# EAGLE design IntegratedSensor (EAGLE 6.3)
Menlo Park Innovation LLC Sensor Front End Electronics
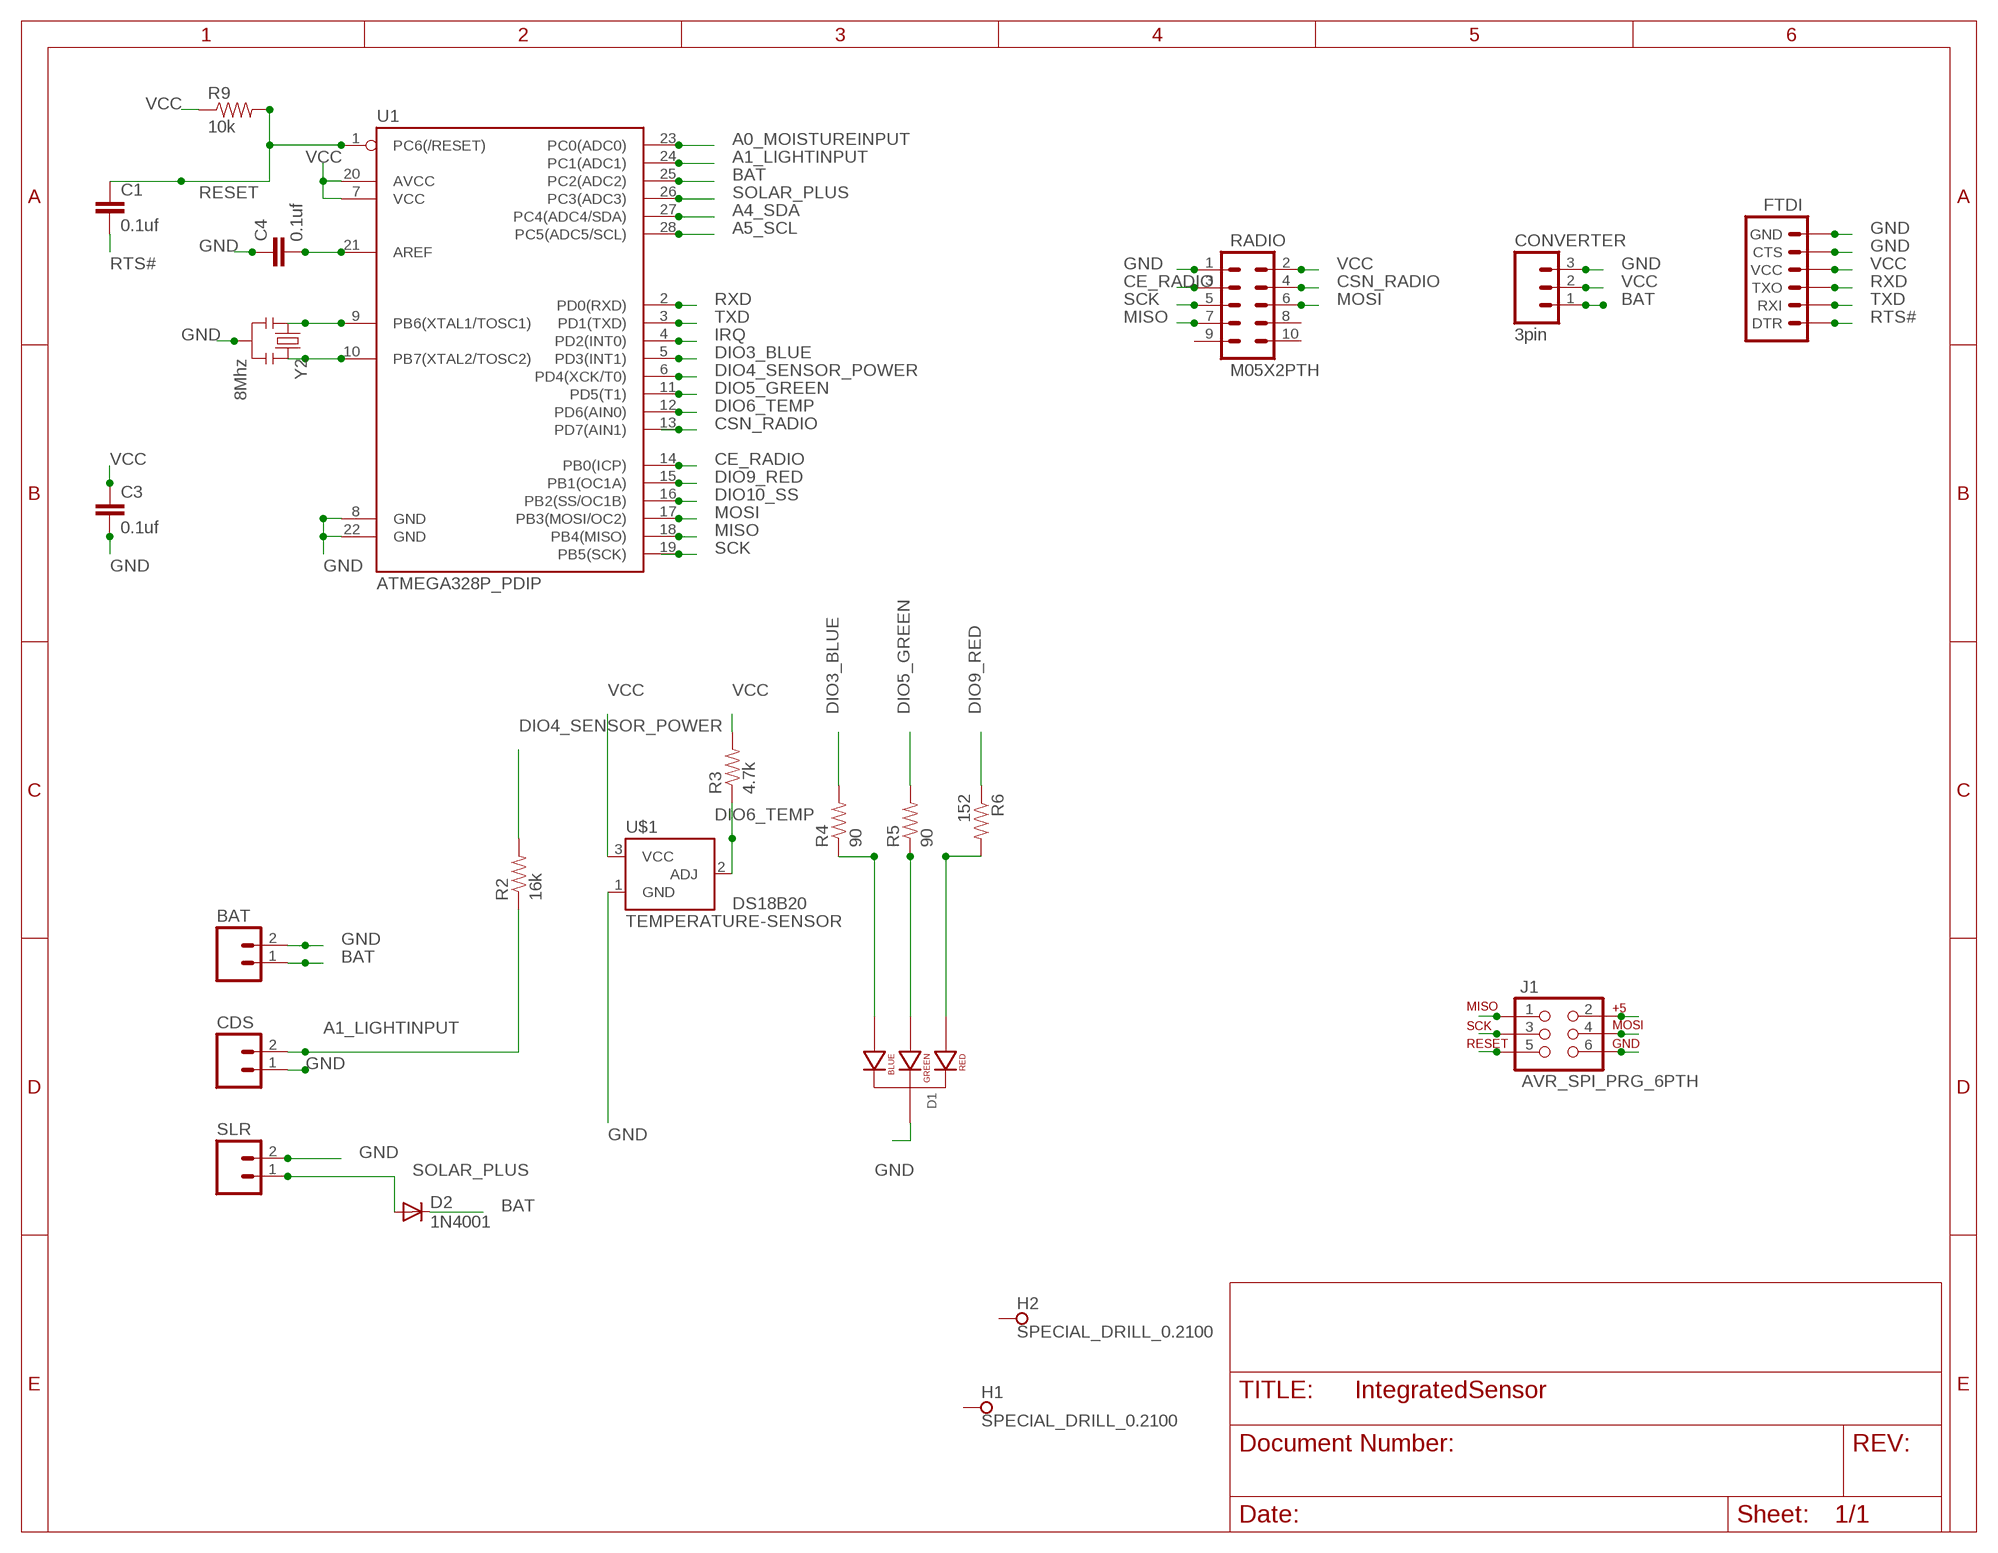
[diagram p0: schematic, sheet 1]

## Parts
BAT  M02PTH  [1X02]
C1  0.1uf  CAPPTH  [CAP-PTH-SMALL]
C3  0.1uf  CAPPTH  [CAP-PTH-SMALL]
C4  0.1uf  CAPPTH  [CAP-PTH-SMALL]
CDS  M02PTH  [1X02]
CONVERTER  3pin  M03PTH  [1X03]
D1  LED-RGB-CC-THRUCLEAR  [LED-RGB-THRU]
D2  1N4001  DIODEPTH  [DIODE-1N4001]
FTDI  ARDUINO_SERIAL_PROGRAMPTH  [1X06]
H1  SPECIAL_DRILL_0.2100  [PAD_0.2100]
H2  SPECIAL_DRILL_0.2100  [PAD_0.2100]
J1  AVR_SPI_PRG_6PTH  [2X3]
R2  16k  RESISTORPTH-1/6W  [1/6W-RES]
R3  4.7k  RESISTORPTH-1/6W  [1/6W-RES]
R4  90  RESISTORPTH-1/6W  [1/6W-RES]
R5  90  RESISTORPTH-1/6W  [1/6W-RES]
R6  152  RESISTORPTH-1/6W  [1/6W-RES]
R9  10k  RESISTORPTH-1/6W  [1/6W-RES]
RADIO  M05X2PTH  [AVR_ICSP]
SLR  M02PTH  [1X02]
U1  ATMEGA328P_PDIP  [DIL28-3]
U$1  TEMPERATURE-SENSOR  [TO-92]
Y2  8Mhz  RESONATORPTH  [RESONATOR-PTH]

## Nets
A0_MOISTUREINPUT: U1.23(PC0(ADC0))
A1_LIGHTINPUT: CDS.2 R2.1 U1.24(PC1(ADC1))
A4_SDA: U1.27(PC4(ADC4/SDA))
A5_SCL: U1.28(PC5(ADC5/SCL))
BAT: BAT.1 CONVERTER.1 D2.C U1.25(PC2(ADC2))
CE_RADIO: RADIO.3 U1.14(PB0(ICP))
CSN_RADIO: RADIO.4 U1.13(PD7(AIN1))
DIO3_BLUE: R4.2 U1.5(PD3(INT1))
DIO4_SENSOR_POWER: R2.2 U1.6(PD4(XCK/T0))
DIO5_GREEN: R5.2 U1.11(PD5(T1))
DIO6_TEMP: R3.1 U1.12(PD6(AIN0)) U$1.2(ADJ)
DIO9_RED: R6.1 U1.15(PB1(OC1A))
DIO10_SS: U1.16(PB2(SS/OC1B))
GND: BAT.2 C3.2 C4.1 CDS.1 CONVERTER.3 D1.2(CATHODE) FTDI.5(CTS) FTDI.6(GND) J1.6 RADIO.1 SLR.2 U1.8(GND) U1.22(GND) U$1.1(GND) Y2.2
IRQ: U1.4(PD2(INT0))
MISO: J1.1 RADIO.7 U1.18(PB4(MISO))
MOSI: J1.4 RADIO.6 U1.17(PB3(MOSI/OC2))
N$1: D1.4(BLUE_CATHODE) R4.1
N$2: D1.3(GREEN_CATHODE) R5.1
N$3: D1.1(RED_CATHODE) R6.2
N$5: U1.9(PB6(XTAL1/TOSC1)) Y2.1
N$6: U1.10(PB7(XTAL2/TOSC2)) Y2.3
N$8: C4.2 U1.21(AREF)
RESET: C1.1 J1.5 R9.2 U1.1(PC6(/RESET))
RTS#: C1.2 FTDI.1(DTR)
RXD: FTDI.3(TXO) U1.2(PD0(RXD))
SCK: J1.3 RADIO.5 U1.19(PB5(SCK))
SOLAR_PLUS: D2.A SLR.1 U1.26(PC3(ADC3))
TXD: FTDI.2(RXI) U1.3(PD1(TXD))
VCC: C3.1 CONVERTER.2 FTDI.4(VCC) J1.2 R3.2 R9.1 RADIO.2 U1.7(VCC) U1.20(AVCC) U$1.3(VCC)
Unconnected: H1.1 H2.1 RADIO.8 RADIO.9 RADIO.10

## Library data of the parts
BAT CDS SLR = SparkFun-Connectors:M02: Header 2 Standard 2-pin 0.1" header. Use with straight break away headers (SKU : PRT-00116), right angle break away headers (PRT-00553), swiss pins (PRT-00743), machine pins (PRT-00117), and female headers (PRT-00115). Molex polarized connector foot print use with SKU : PRT-08233 with associated crimp pins and housings.
C1 C3 C4 = SparkFun-Capacitors:CAP: Capacitor Standard 0603 ceramic capacitor, and 0.1" leaded capacitor.
CONVERTER = SparkFun-Connectors:M03: Header 3 Standard 3-pin 0.1" header. Use with straight break away headers (SKU : PRT-00116), right angle break away headers (PRT-00553), swiss pins (PRT-00743), machine pins (PRT-00117), and female headers (PRT-00115). Molex polarized connector foot print use with SKU : PRT-08232 with associated crimp pins and housings.
D1 = SparkFun-LED-MenloFix:LED-RGB-CC-THRU: RGB Through-hole common cathode LED SparkFun Storefront: COM-00105 (Clear) COM-09264 (Diffuse); PROD_ID: DIO-08418
D2 = SparkFun-DiscreteSemi:DIODE: Diode These are standard reverse protection diodes and small signal diodes. SMA package can handle up to about 1A. SOD-323 can handle about 200mA. What the SOD-323 package when ordering, there are some mfgs out there that are 5-pin packages.
FTDI = SparkFun-Connectors:ARDUINO_SERIAL_PROGRAM: FTDI connector footprints
H1 H2 = special-drill:SPECIAL_DRILL_: Special drills
J1 = SparkFun-Connectors:AVR_SPI_PRG_6: AVR ISP 6 Pin This is the reduced ISP connector for AVR programming. Common on Arduino. This footprint will take up less PCB space and can be used with a 10-pin to 6-pin adapter such as SKU: BOB-08508
R2-R6 R9 = SparkFun-Resistors:RESISTOR: Resistor Basic schematic elements and footprints for 0603, 1206, and PTH resistors.
RADIO = SparkFun-Connectors:M05X2: Header 5x2 Standard 10-pin dual row 0.1" header. Commonly used with AVR-ISP. Use with Spark Fun Electronics SKU: PRT-00778
U1 = SparkFun-DigitalIC:ATMEGA328P_PDIP: uC used in the Arduino 32kb flash, 1k EEPROM, 2k SRAM This is the through-hole version of this chip.
U$1 = SparkFun-Sensors:TEMPERATURE-SENSOR: TO-92 temp sensor; PARTNAME: DS18B20
Y2 = SparkFun-FreqCtrl:RESONATOR: Resonator Small SMD resonator. Used, eg, on the Arduino Pro/ Pro Mini boards. 8MHz- XTAL-08895 16MHz- XTAL-08900

## Board
MenloSensor1
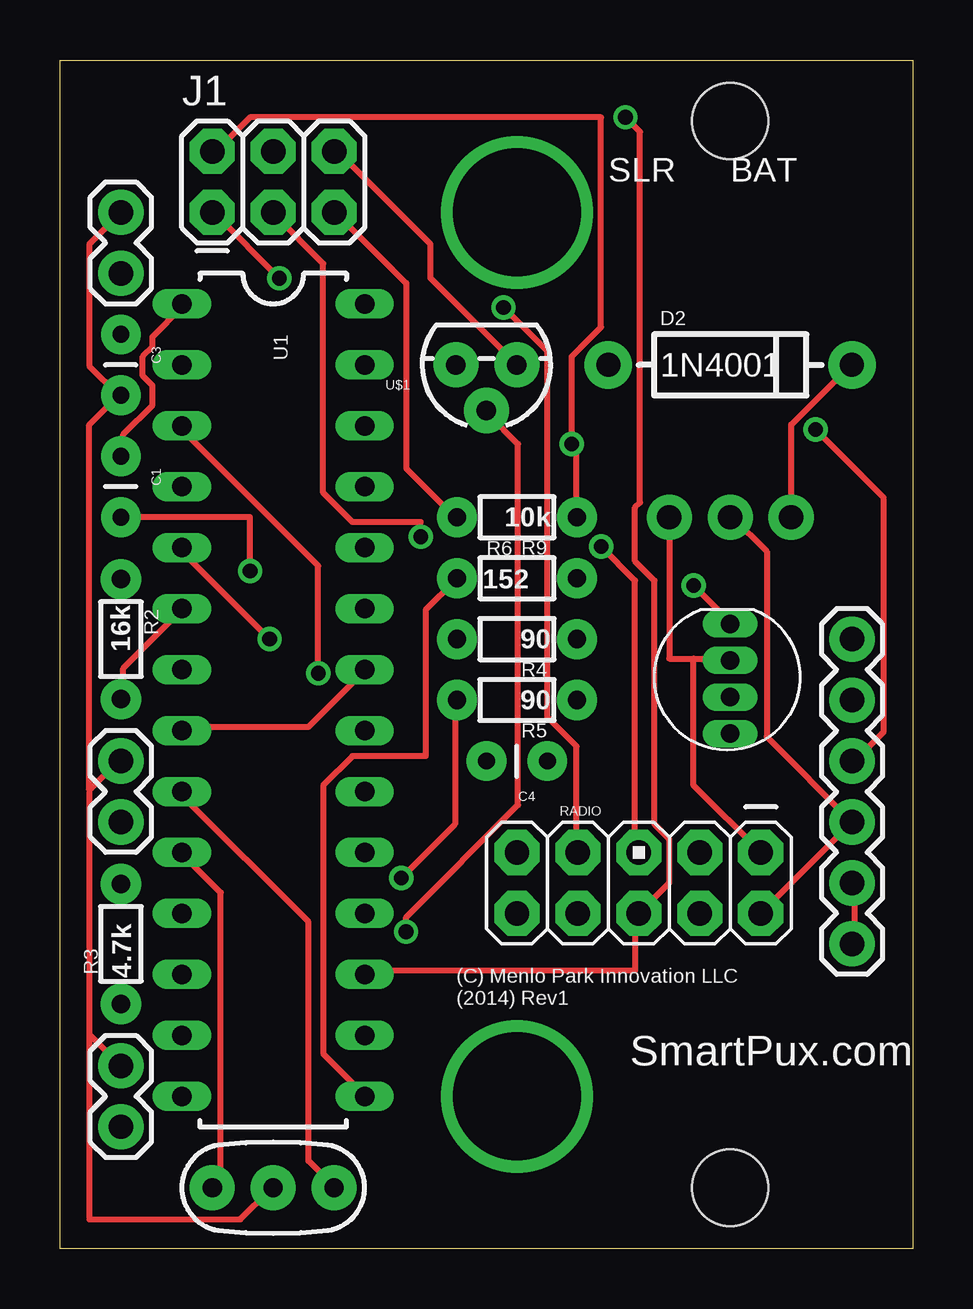
[diagram p1: board, top side]
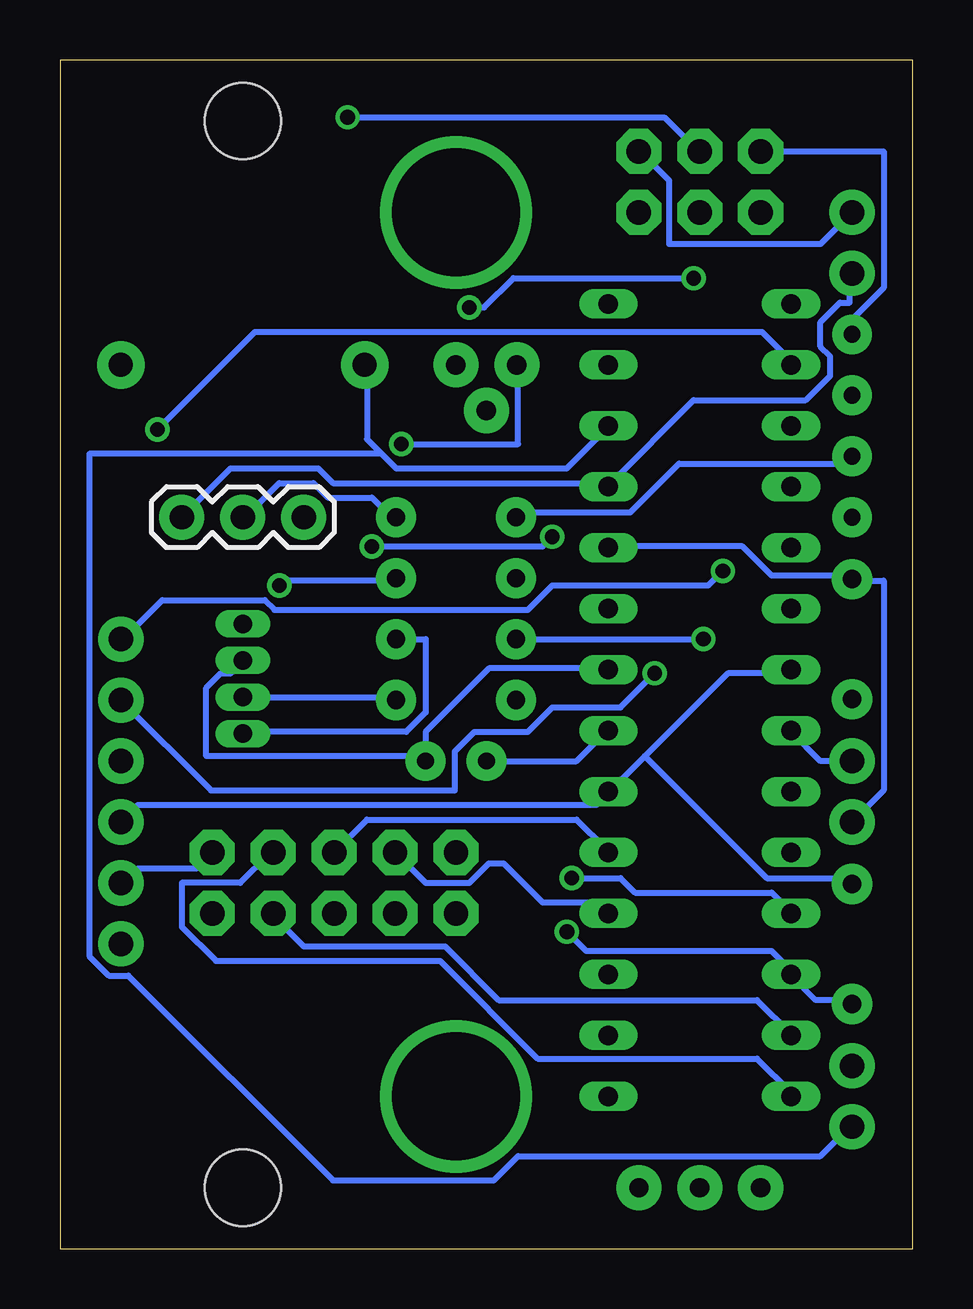
[diagram p2: board, bottom side, seen from below]

Size 35.56 x 49.53 mm. Coordinates in mm from the lower left corner, seen from the top.
Outline: 0,0 0,49.53 35.56,49.53 35.56,0 0,0
Copper layers (1*16): Top 0.035mm / dielectric 1.5mm / Bottom 0.035mm
Design rules "default *": minimum track width 10mil, minimum drill 24mil, track to track 8mil, track to pad 8mil, pad to pad 8mil, via to via 8mil, smd to smd 8mil, copper to edge 40mil, drill to drill 8mil, minimum pad ring 0mil, minimum via ring 8mil, stop-mask expansion 4mil, vias tented up to drill 0mil, thermal gap 10mil

### Footprints (pad centres in the part's own frame; a part is rotated, then mirrored left to right if it is on the bottom)
1X02 = drill 1.016 pad 1.88: 1 0,0; 2 2.54,0
CAP-PTH-SMALL = drill 0.7 pad 1.651: 1 0,0; 2 2.54,0
1X03 = drill 1.016 pad 1.88: 1 0,0; 2 2.54,0; 3 5.08,0
LED-RGB-THRU = drill 0.762 pad 0.889 long: 1 1.905,0; 2 0.381,0; 3 -1.143,0; 4 -2.667,0
DIODE-1N4001 = drill 1 pad 1.981: A -5.08,0; C 5.08,0
1X06 = drill 1.016 pad 1.88: 1 0,0; 2 2.54,0; 3 5.08,0; 4 7.62,0; 5 10.16,0; 6 12.7,0
PAD_0.2100 = drill 5.334 pad 5.334: 1 0,0
2X3 = drill 1.016 pad 1.88 octagon: 1 0,0; 2 0,2.54; 3 2.54,0; 4 2.54,2.54; 5 5.08,0; 6 5.08,2.54
1/6W-RES = drill 0.762 pad 1.676: 1 -2.5,0; 2 2.5,0
AVR_ICSP = drill 1.016 pad 1.88 octagon: 1 -1.27,5.08; 2 1.27,5.08; 3 -1.27,2.54; 4 1.27,2.54; 5 -1.27,0; 6 1.27,0; 7 -1.27,-2.54; 8 1.27,-2.54; 9 -1.27,-5.08; 10 1.27,-5.08
DIL28-3 = drill 0.813 long: 1 -16.51,-3.81; 2 -13.97,-3.81; 3 -11.43,-3.81; 4 -8.89,-3.81; 5 -6.35,-3.81; 6 -3.81,-3.81; 7 -1.27,-3.81; 8 1.27,-3.81; 9 3.81,-3.81; 10 6.35,-3.81; 11 8.89,-3.81; 12 11.43,-3.81; 13 13.97,-3.81; 14 16.51,-3.81; 15 16.51,3.81; 16 13.97,3.81; 17 11.43,3.81; 18 8.89,3.81; 19 6.35,3.81; 20 3.81,3.81; 21 1.27,3.81; 22 -1.27,3.81; 23 -3.81,3.81; 24 -6.35,3.81; 25 -8.89,3.81; 26 -11.43,3.81; 27 -13.97,3.81; 28 -16.51,3.81
TO-92 = drill 0.813 pad 1.88: 1 -1.27,0; 2 0,1.905; 3 1.27,0
DRILL_0.1250 = hole 3.175: 0,0
RESONATOR-PTH = drill 0.8 pad 1.88: 1 -2.54,0; 2 0,0; 3 2.54,0

### Placement (x,y rotation side)
BAT  2.54,40.64 90 top
C1  2.54,33.02 270 top
C3  2.54,38.1 270 top
C4  20.32,20.32 180 top
CDS  2.54,20.32 270 top
CONVERTER  30.48,30.48 0 bottom
D1  27.94,24.13 90 top
D2  27.94,36.83 0 top
FTDI  33.02,25.4 270 top
H1  19.05,43.18 0 top
H2  19.05,6.35 0 top
J1  6.35,43.18 0 top
R2  2.54,25.4 270 top
R3  2.54,12.7 90 top
R4  19.05,25.4 180 top
R5  19.05,22.86 180 top
R6  19.05,27.94 0 top
R9  19.05,30.48 180 top
RADIO  24.13,15.24 270 top
SLR  2.54,5.08 90 top
U1  8.89,22.86 270 top
U$1  17.78,36.83 180 top
U$2  [DRILL_0.1250]  27.94,2.54 0 top
U$3  [DRILL_0.1250]  27.94,46.99 0 top
Y2  8.89,2.54 180 top

### Tracks (layer width: path | path; a pad name or v marks a point on that pad's centre or on a via)
A1_LIGHTINPUT
  Bottom 0.254: U1.24 12.6,29.26 7.11,29.26 5.89,28.04 2.64,28.04 R2.1 2.44,27.84 1.22,27.84 1.22,19.1 CDS.2
BAT
  Top 0.254: CONVERTER.1 30.48,34.34 32.92,36.78 D2.C
  Bottom 0.254: CONVERTER.1 28.45,32.51 24.79,32.51 24.18,31.9 12.8,31.9 U1.25 12.6,31.9 9.14,35.36 4.47,35.36 3.45,36.37 3.45,37.19 3.86,37.59 3.86,38.61 3.05,39.42 2.64,39.42 2.64,40.64 BAT.1
CE_RADIO
  Bottom 0.254: U1.14 5.08,6.5 6.5,7.92 15.65,7.92 19.71,11.99 29.06,11.99 30.48,13.41 30.48,15.24 28.04,15.24 26.82,16.46 RADIO.3
CSN_RADIO
  Bottom 0.254: U1.13 5.08,8.94 6.5,10.36 17.27,10.36 19.51,12.6 25.4,12.6 26.62,13.82 RADIO.4
DIO3_BLUE  (via drill 0.61)
  Top 0.254: v8.74,25.4 5.08,29.06 U1.5
  Bottom 0.254: R4.2 v8.74,25.4
DIO4_SENSOR_POWER
  Top 0.254: U1.6 5.08,26.62 2.64,24.18 2.64,22.96 R2.2
DIO5_GREEN  (via drill 0.61)
  Top 0.254: v14.22,15.44 16.46,17.68 16.46,22.76 R5.2
  Bottom 0.254: v14.22,15.44 12.19,15.44 11.58,14.83 5.89,14.83 5.08,14.02 U1.11
DIO6_TEMP  (via drill 0.61)
  Top 0.254: v14.43,13.21 14.43,13.82 19.1,18.49 19.1,33.53 17.88,34.75 U$1.2
  Bottom 0.254: R3.1 2.64,10.36 4.06,10.36 5.08,11.38 U1.12 5.08,11.58 5.89,12.39 13.61,12.39 v14.43,13.21
DIO9_RED
  Top 0.254: U1.15 12.6,6.5 10.97,8.13 10.97,19.3 12.19,20.52 15.24,20.52 15.24,26.62 16.46,27.84 R6.1
GND
  Top 0.254: 26.42,24.59 25.4,24.59 CONVERTER.3 | 26.42,24.59 27.84,24.59 D1.2 | FTDI.6 33.12,12.8 33.12,15.24 FTDI.5 | 26.42,24.59 26.42,19.3 RADIO.1 | U$1.1 15.44,40.44 15.44,41.86 11.58,45.72 J1.6 | 2.44,35.56 1.22,36.78 1.22,41.86 BAT.2 | U1.22 12.6,23.98 10.36,21.74 5.08,21.74 U1.8 | 1.22,8.94 SLR.2 | 1.22,19.1 1.22,8.94 | 1.22,19.1 2.44,20.32 CDS.1 | 1.22,8.94 1.22,1.22 7.52,1.22 8.74,2.44 Y2.2 | 2.44,35.56 1.22,34.34 1.22,19.1 | 2.44,35.56 C3.2
  Bottom 0.254: RADIO.1 29.87,15.85 32.31,15.85 32.92,15.24 FTDI.5 | CDS.1 3.86,20.32 5.08,21.54 U1.8 | 20.32,20.52 20.32,21.54 17.68,24.18 12.8,24.18 U1.22 | BAT.2 3.86,41.86 10.16,41.86 10.16,44.5 11.38,45.72 J1.6 | 20.32,20.52 29.46,20.52 29.46,23.37 28.85,23.98 28.45,23.98 28.04,24.38 D1.2 | 20.32,20.52 C4.1
MISO  (via drill 0.61)
  Top 0.254: v9.14,40.44 6.5,43.08 J1.1 | v18.49,39.22 20.32,37.39 20.32,22.15 21.54,20.93 21.54,16.66 RADIO.7
  Bottom 0.254: RADIO.7 20.32,15.24 18.49,15.24 17.68,16.05 17.07,16.05 15.44,14.43 13.21,14.43 12.8,14.02 U1.18 | v9.14,40.44 16.66,40.44 17.88,39.22 v18.49,39.22
MOSI  (via drill 0.61)
  Top 0.254: U1.17 12.8,11.58 23.98,11.58 23.98,13.82 RADIO.6 25.4,15.24 25.4,17.07 24.79,17.68 24.79,27.84 23.98,28.65 23.98,30.89 24.18,31.09 24.18,46.53 v23.57,47.14
  Bottom 0.254: v23.57,47.14 10.36,47.14 8.94,45.72 J1.4
N$1
  Bottom 0.254: R4.1 20.32,25.4 20.32,22.35 21.13,21.54 27.84,21.54 D1.4
N$2
  Bottom 0.254: D1.3 27.84,22.96 21.74,22.96 R5.1
N$3  (via drill 0.61)
  Top 0.254: v26.42,27.64 27.84,26.21 D1.1
  Bottom 0.254: v26.42,27.64 26.21,27.84 21.74,27.84 R6.2
N$5
  Top 0.254: U1.9 5.08,18.9 10.36,13.61 10.36,3.66 11.38,2.64 Y2.1
N$6
  Top 0.254: U1.10 5.08,16.46 6.71,14.83 6.71,2.85 6.5,2.64 Y2.3
N$8
  Bottom 0.254: C4.2 14.02,20.32 12.8,21.54 U1.21
RESET
  Top 0.254: U1.1 5.08,39.22 3.86,38 3.86,37.59 3.45,37.19 3.45,36.37 3.86,35.97 3.86,35.15 2.64,33.93 2.64,33.12 C1.1 | R9.2 16.46,30.48 14.43,32.51 14.43,40.23 11.58,43.08 J1.5
  Bottom 0.254: C1.1 2.85,32.72 9.75,32.72 11.79,30.68 16.26,30.68 16.46,30.48 R9.2
RTS#  (via drill 0.61)
  Top 0.254: C1.2 7.92,30.48 v7.92,28.25
  Bottom 0.254: v7.92,28.25 8.53,27.64 15.04,27.64 16.05,26.62 26.62,26.62 27.03,27.03 31.29,27.03 32.92,25.4 FTDI.1
RXD  (via drill 0.61)
  Top 0.254: v31.5,34.14 34.34,31.29 34.34,21.54 33.12,20.32 FTDI.3
  Bottom 0.254: v31.5,34.14 27.43,38.2 6.3,38.2 5.08,36.98 U1.2
SCK  (via drill 0.61)
  Top 0.254: v15.04,29.67 15.04,30.28 12.19,30.28 10.97,31.5 10.97,41.05 8.94,43.08 J1.3 | v22.55,29.26 23.98,27.84 23.98,16.66 RADIO.5
  Bottom 0.254: RADIO.5 22.76,17.88 14.02,17.88 12.8,16.66 U1.19 | v15.04,29.67 15.44,29.26 v22.55,29.26
SOLAR_PLUS
  Bottom 0.254: 22.15,33.12 22.76,33.73 22.76,36.78 D2.A | 22.15,33.12 21.54,32.51 14.43,32.51 12.8,34.14 U1.26 | 22.15,33.12 34.34,33.12 34.34,12.19 33.53,11.38 32.72,11.38 24.18,2.85 17.48,2.85 16.46,3.86 3.86,3.86 2.64,5.08 SLR.1
TXD  (via drill 0.61)
  Top 0.254: v10.77,23.98 10.77,28.45 5.08,34.14 U1.3
  Bottom 0.254: v10.77,23.98 12.19,22.55 15.04,22.55 16.05,21.54 18.29,21.54 19.1,20.73 19.1,19.1 29.26,19.1 FTDI.2
VCC  (via drill 0.61)
  Top 0.254: RADIO.2 FTDI.4 29.46,21.34 29.46,29.06 28.04,30.48 CONVERTER.2 | R9.1 21.54,33.33 v21.34,33.53 21.34,37.19 22.55,38.41 22.55,47.14 7.92,47.14 6.5,45.72 J1.2
  Bottom 0.254: 11.18,20.52 7.72,23.98 5.08,23.98 U1.7 | 11.18,20.52 12.6,19.1 U1.20 12.8,18.9 13.21,18.49 32.31,18.49 FTDI.4 | 11.18,20.52 6.1,15.44 2.85,15.44 2.64,15.24 R3.2 | J1.2 1.22,45.72 1.22,40.03 2.44,38.81 2.44,38.2 C3.1 | R9.1 21.74,30.48 22.55,31.29 24.38,31.29 24.99,31.9 26.42,31.9 27.84,30.48 CONVERTER.2 | v21.34,33.53 16.46,33.53 16.46,36.78 U$1.3

### Text on the board
tPlace: SLR | BAT | (C) Menlo Park Innovation LLC / (2014) Rev1 | SmartPux.com